# Altium schematic sheet ADC_INPUT_FILTER.SchDoc
size A4
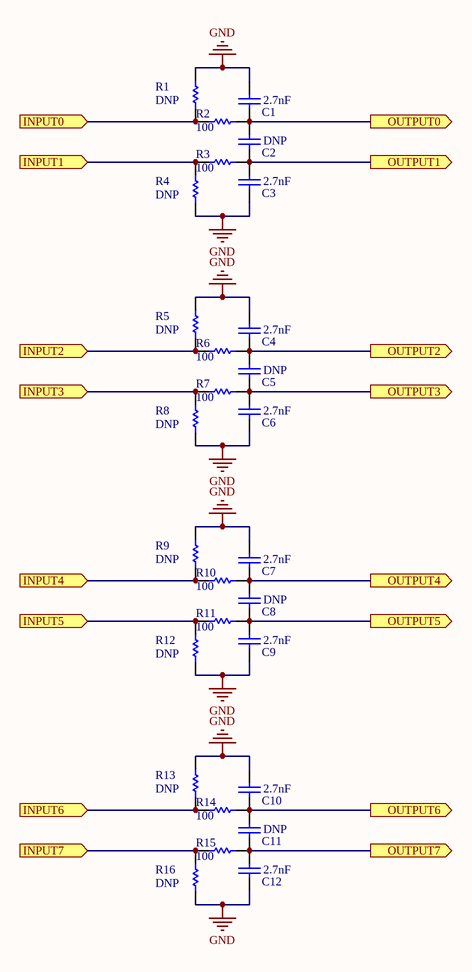
[diagram p0: ADC_INPUT_FILTER.SchDoc]

## Parts
C1  value 2.7nF  [CAPC0402(1005)60_L]  (hidden comment: CAP0402)
C2  value DNP  [CAPC0402(1005)60_L]  (hidden comment: CAP0402)
C3  value 2.7nF  [CAPC0402(1005)60_L]  (hidden comment: CAP0402)
C4  value 2.7nF  [CAPC0402(1005)60_L]  (hidden comment: CAP0402)
C5  value DNP  [CAPC0402(1005)60_L]  (hidden comment: CAP0402)
C6  value 2.7nF  [CAPC0402(1005)60_L]  (hidden comment: CAP0402)
C7  value 2.7nF  [CAPC0402(1005)60_L]  (hidden comment: CAP0402)
C8  value DNP  [CAPC0402(1005)60_L]  (hidden comment: CAP0402)
C9  value 2.7nF  [CAPC0402(1005)60_L]  (hidden comment: CAP0402)
C10  value 2.7nF  [CAPC0402(1005)60_L]  (hidden comment: CAP0402)
C11  value DNP  [CAPC0402(1005)60_L]  (hidden comment: CAP0402)
C12  value 2.7nF  [CAPC0402(1005)60_L]  (hidden comment: CAP0402)
R1  value DNP  [RESC0402(1005)_L]  (hidden comment: RES0402)
R2  value 100  [RESC0402(1005)_L]  (hidden comment: RES0402)
R3  value 100  [RESC0402(1005)_L]  (hidden comment: RES0402)
R4  value DNP  [RESC0402(1005)_L]  (hidden comment: RES0402)
R5  value DNP  [RESC0402(1005)_L]  (hidden comment: RES0402)
R6  value 100  [RESC0402(1005)_L]  (hidden comment: RES0402)
R7  value 100  [RESC0402(1005)_L]  (hidden comment: RES0402)
R8  value DNP  [RESC0402(1005)_L]  (hidden comment: RES0402)
R9  value DNP  [RESC0402(1005)_L]  (hidden comment: RES0402)
R10  value 100  [RESC0402(1005)_L]  (hidden comment: RES0402)
R11  value 100  [RESC0402(1005)_L]  (hidden comment: RES0402)
R12  value DNP  [RESC0402(1005)_L]  (hidden comment: RES0402)
R13  value DNP  [RESC0402(1005)_L]  (hidden comment: RES0402)
R14  value 100  [RESC0402(1005)_L]  (hidden comment: RES0402)
R15  value 100  [RESC0402(1005)_L]  (hidden comment: RES0402)
R16  value DNP  [RESC0402(1005)_L]  (hidden comment: RES0402)

## Ports
INPUT0 (in), INPUT1 (in), INPUT2 (in), INPUT3 (in), INPUT4 (in), INPUT5 (in), INPUT6 (in), INPUT7 (in), OUTPUT0 (out), OUTPUT1 (out), OUTPUT2 (out), OUTPUT3 (out), OUTPUT4 (out), OUTPUT5 (out), OUTPUT6 (out), OUTPUT7 (out)

## Nets
GND: C1.2 C3.1 C4.2 C6.1 C7.2 C9.1 C10.2 C12.1 R1.2 R4.1 R5.2 R8.1 R9.2 R12.1 R13.2 R16.1
INPUT0: R1.1 R2.1 ; port INPUT0
INPUT1: R3.1 R4.2 ; port INPUT1
INPUT2: R5.1 R6.1 ; port INPUT2
INPUT3: R7.1 R8.2 ; port INPUT3
INPUT4: R9.1 R10.1 ; port INPUT4
INPUT5: R11.1 R12.2 ; port INPUT5
INPUT6: R13.1 R14.1 ; port INPUT6
INPUT7: R15.1 R16.2 ; port INPUT7
OUTPUT0: C1.1 C2.2 R2.2 ; port OUTPUT0
OUTPUT1: C2.1 C3.2 R3.2 ; port OUTPUT1
OUTPUT2: C4.1 C5.2 R6.2 ; port OUTPUT2
OUTPUT3: C5.1 C6.2 R7.2 ; port OUTPUT3
OUTPUT4: C7.1 C8.2 R10.2 ; port OUTPUT4
OUTPUT5: C8.1 C9.2 R11.2 ; port OUTPUT5
OUTPUT6: C10.1 C11.2 R14.2 ; port OUTPUT6
OUTPUT7: C11.1 C12.2 R15.2 ; port OUTPUT7

## Library data of the parts
C1-C12 = CMP-1590-00004-1: 0402 (1005 Metric) Chip Capacitor; Case-EIA: 0402; Case-Metric: 1005; PackageReference: CAPC0402(1005)60
R1-R16 = CMP-1591-00004-1: 0402 (1005 Metric) Chip Resistor; Case-EIA: 0402; Case-Metric: 1005; PackageReference: RESC0402(1005)